# EAGLE design sistem hidroponik (EAGLE 9.5.1)
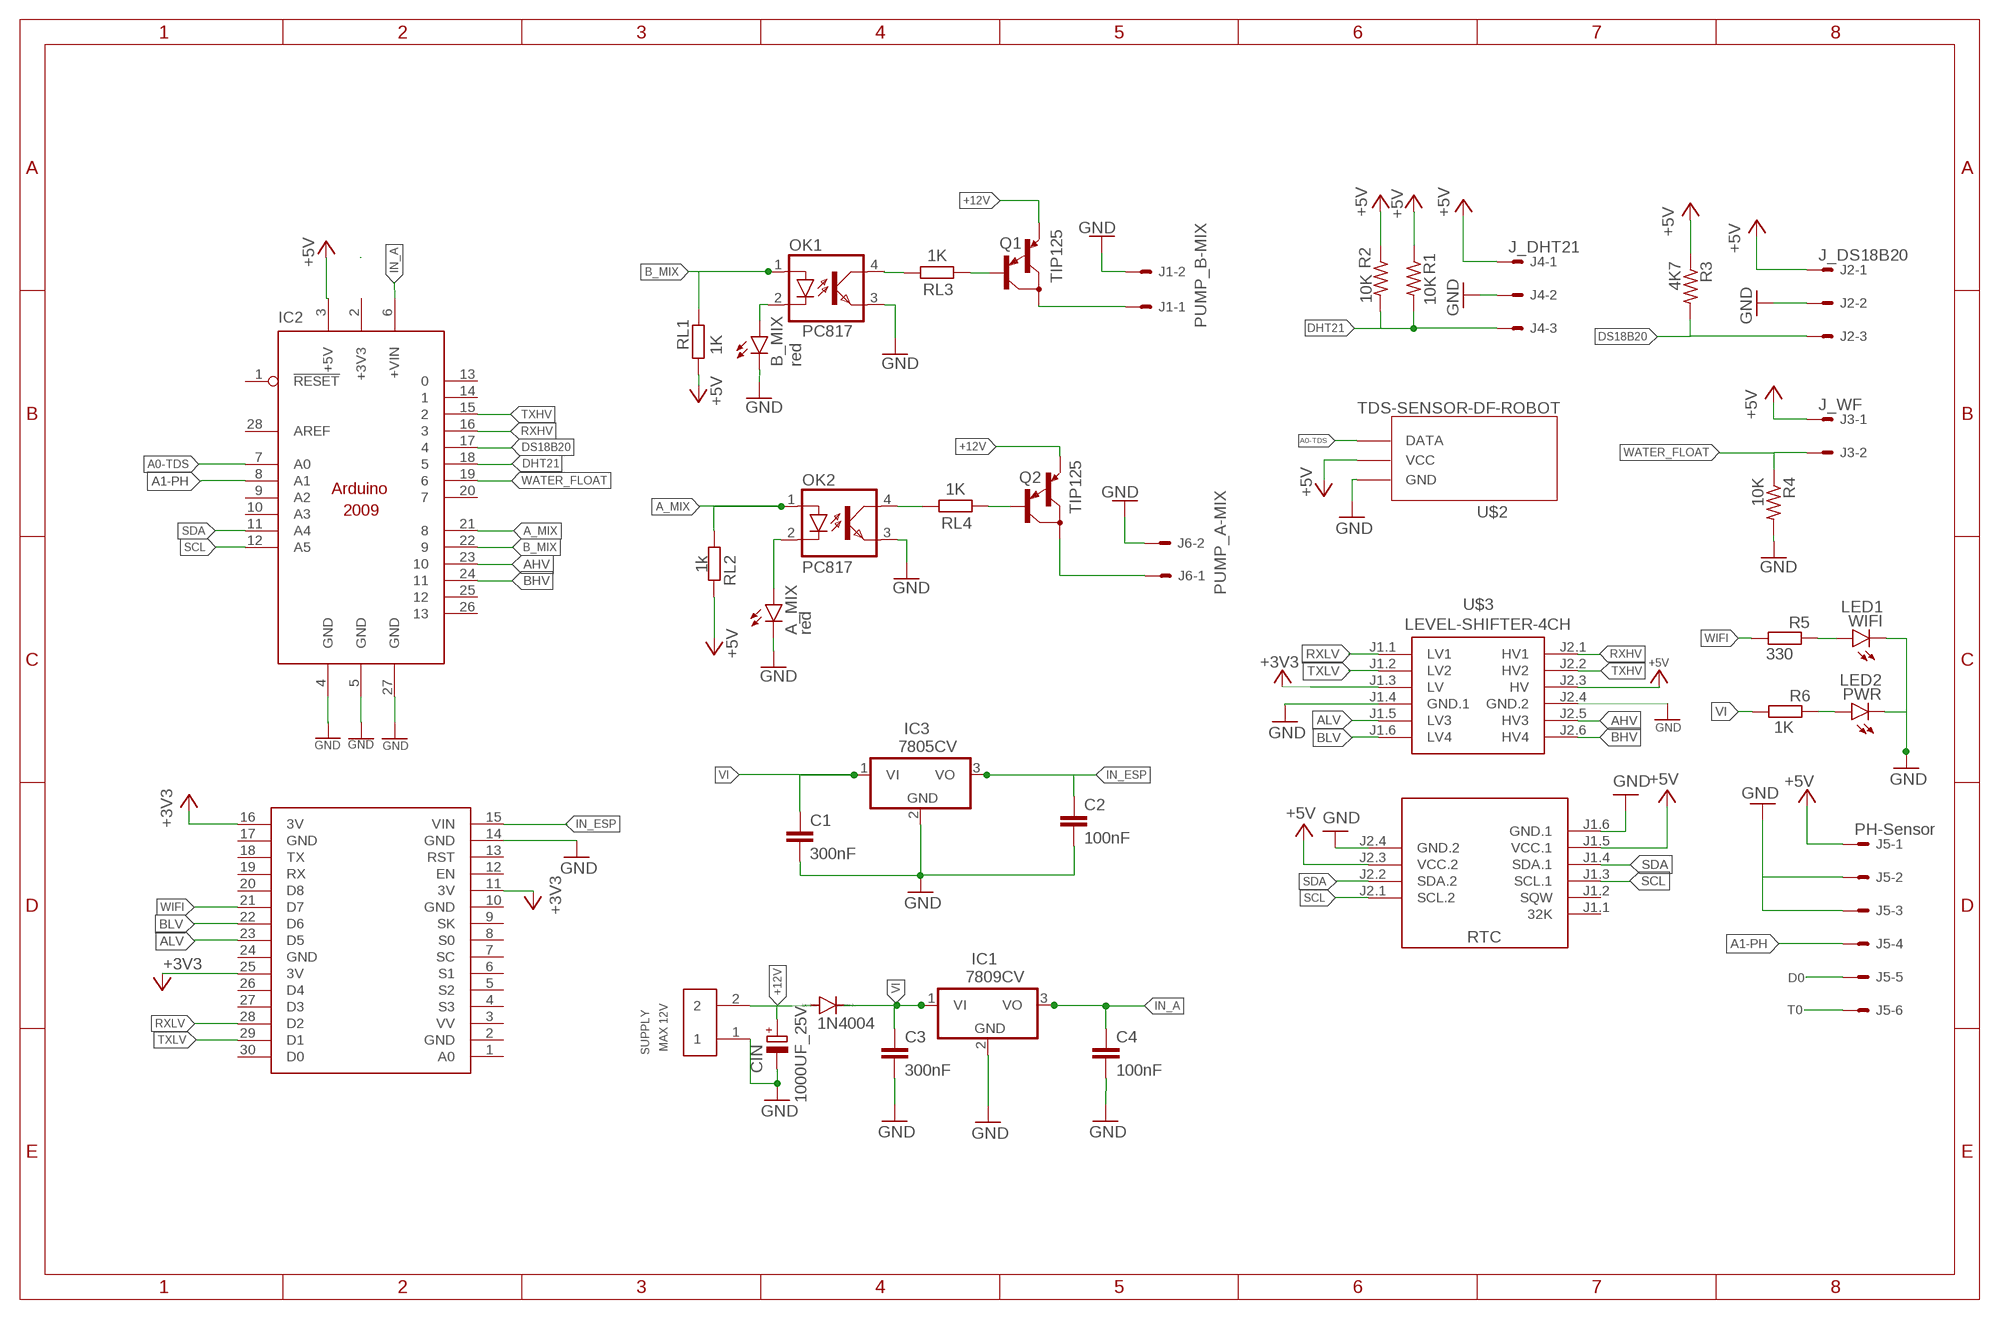
[diagram p0: schematic, sheet 1]

## Parts
1K  R6  R-EU_0207/7  [0207/7]
330  R5  R-EU_0207/7  [0207/7]
A_MIX  red  TLLR4400  [LED3MM]
B_MIX  red  TLLR4400  [LED3MM]
C1  300nF  C-EU025-030X050  [C025-030X050]
C2  100nF  C-EU025-030X050  [C025-030X050]
C3  300nF  C-EU025-030X050  [C025-030X050]
C4  100nF  C-EU025-030X050  [C025-030X050]
CIN  1000UF_25V  CPOL-EUE3.5-8  [E3,5-8]
D1  1N4004  [DO41-10]
IC1  7809CV  7805T  [TO220H]
IC2  ARDUINO2009_10  [ARDUINO2009]
IC3  7805CV  7805T  [TO220H]
J1  PUMP_B-MIX  22-27-2021-02  [6410-02]
J2  J_DS18B20  22-27-2031-03  [6410-03]
J3  J_WF  22-27-2021-02  [6410-02]
J4  J_DHT21  22-27-2031-03  [6410-03]
J5  PH-Sensor  22-27-2061-06  [6410-06]
J6  PUMP_A-MIX  22-27-2021-02  [6410-02]
OK1  PC817  [DIL04]
OK2  PC817  [DIL04]
PWR  LED2  TLLR4400  [LED3MM]
Q1  TIP125  [TO220]
Q2  TIP125  [TO220]
R1  10K  R-US_0204/7  [0204/7]
R2  10K  R-US_0204/7  [0204/7]
R3  4K7  R-US_0204/7  [0204/7]
R4  10K  R-US_0204/7  [0204/7]
RL1  1K  R-EU_0207/7  [0207/7]
RL2  1k  R-EU_0207/7  [0207/7]
RL3  1K  R-EU_0207/7  [0207/7]
RL4  1K  R-EU_0207/7  [0207/7]
RTC  RTC-DS3231-AT24C32  [RTC-DS3231-AT24C32]
SUPPLY  MAX 12V  TBLOCK-2PIN  [OST_TBLOCK-2PIN]
U$1  NODEMCU  [NODEMCU]
U$2  TDS-SENSOR-DF-ROBOT  TDS-SENSORDF-ROBOT  [TDS-SENSOR]
U$3  LEVEL-SHIFTER-4CH  [LEVEL-SHIFTER-4CH]
WIFI  LED1  TLLR4400  [LED3MM]

## Nets
+3V3: U$1.11(3V) U$1.16(3V) U$1.25(3V) U$3.J1.3(LV)
+5V: IC2.3(+5V) J2.1 J3.1 J4.1 J5.1 R1.1 R2.1 R3.1 RL1.1 RL2.2 RTC.J1.5(VCC.1) RTC.J2.3(VCC.2) U$2.VCC U$3.J2.3(HV)
+12V: CIN.+ D1.A Q1.3(E) Q2.3(E) SUPPLY.2
A0-TDS: IC2.7(A0) U$2.A(DATA)
A1-PH: IC2.8(A1) J5.4
A_MIX: IC2.21 OK2.1(A) RL2.1
AHV: IC2.23 U$3.J2.5(HV3)
ALV: U$1.23(D5) U$3.J1.5(LV3)
B_MIX: IC2.22 OK1.1(A) RL1.2
BHV: IC2.24 U$3.J2.6(HV4)
BLV: U$1.22(D6) U$3.J1.6(LV4)
D0: J5.5
DHT21: IC2.18 J4.3 R1.2 R2.2
DS18B20: IC2.17 J2.3 R3.2
GND: A_MIX.K(C) B_MIX.K(C) C1.2 C2.2 C3.2 C4.2 CIN.- IC1.2(GND) IC2.4(GND) IC2.5(GND) IC2.27(GND) IC3.2(GND) J1.2 J2.2 J4.2 J5.2 J5.3 J6.2 OK1.3(EMIT) OK2.3(EMIT) PWR.K(C) R4.2 RTC.J1.6(GND.1) RTC.J2.4(GND.2) SUPPLY.1 U$1.14(GND) U$2.GND U$3.J1.4(GND.1) U$3.J2.4(GND.2) WIFI.K(C)
IN_A: C4.1 IC1.3(VO) IC2.6(+VIN)
IN_ESP: C2.1 IC3.3(VO) U$1.15(VIN)
N$2: J1.1 Q1.2(C)
N$5: 330.1 WIFI.A
N$6: J6.1 Q2.2(C)
N$8: 1K.1 PWR.A
N$9: B_MIX.A OK1.2(C)
N$10: A_MIX.A OK2.2(C)
N$11: OK2.4(COL) RL4.2
N$14: Q2.1(B) RL4.1
N$15: Q1.1(B) RL3.1
N$16: OK1.4(COL) RL3.2
RXHV: IC2.16 U$3.J2.1(HV1)
RXLV: U$1.28(D2) U$3.J1.1(LV1)
SCL: IC2.12(A5) RTC.J1.3(SCL.1) RTC.J2.1(SCL.2)
SDA: IC2.11(A4) RTC.J1.4(SDA.1) RTC.J2.2(SDA.2)
T0: J5.6
TXHV: IC2.15 U$3.J2.2(HV2)
TXLV: U$1.29(D1) U$3.J1.2(LV2)
VI: 1K.2 C1.1 C3.1 D1.C IC1.1(VI) IC3.1(VI)
WATER_FLOAT: IC2.19 J3.2 R4.1
WIFI: 330.2 U$1.21(D7)
Unconnected: IC2.1(!RESET) IC2.9(A2) IC2.10(A3) IC2.13 IC2.14 IC2.20 IC2.25 IC2.26 IC2.28(AREF) RTC.J1.1(32K) RTC.J1.2(SQW) U$1.1(A0) U$1.3(VV) U$1.4(S3) U$1.5(S2) U$1.6(S1) U$1.7(SC) U$1.8(S0) U$1.9(SK) U$1.12(EN) U$1.13(RST) U$1.18(TX) U$1.19(RX) U$1.20(D8) U$1.26(D4) U$1.27(D3) U$1.30(D0)

## Power pins joined to a net without a drawn wire
+3V3: IC2.2(+3V3)
GND: U$1.2(GND) U$1.10(GND) U$1.17(GND) U$1.24(GND)

## Library data of the parts
1K 330 RL1-RL4 = resistor:R-EU_: RESISTOR, European symbol
A_MIX B_MIX PWR WIFI = led:TLLR4400: Low Current (2mA) LED 3 mm Tinted Diffused Package color RED Source: Data sheet <http://www.farnell.com/datasheets/391100.pdf>; MF: VISHAY SEMICONDUCTOR; OC_FARNELL: 1612437
C1-C4 = rcl:C-EU: CAPACITOR, European symbol; SPICEPREFIX: C
CIN = rcl:CPOL-EU: POLARIZED CAPACITOR, European symbol; SPICEPREFIX: C
D1 = diode:1N4004: DIODE general purpose rectifier, 1 A
IC1 IC3 = linear:78*: Positive VOLTAGE REGULATOR Source: http://cache.national.com/ds/LM/LM78L05.pdf http://www.fairchildsemi.com/ds/LM/LM7805.pdf
IC2 = arduino:ARDUINO2009_1: The Arduino Duemilanove ("2009") is a microcontroller board based on the ATmega168 or ATmega328. - 14 digital input/output pins (of which 6 can be used as PWM outputs) - 6 analog inputs, a 16 MHz crystal oscillator - USB connection - power jack - ISP header - reset button It contains everything needed to support the microcontroller; simply connect it to a computer with a USB cable or power it with a AC-to-DC adapter or battery to get started http://arduino.cc/en/Main/ArduinoBoardDuemilanove
J1 J3 J6 = con-molex:22-?-02: CONNECTOR wire to board 2.54 mm (.1 inch) pitch header; MF: MOLEX; OC_FARNELL: unknown; OC_NEWARK: unknown
J2 J4 = con-molex:22-?-03: CONNECTOR wire to board 2.54 mm (.1 inch) pitch header; MF: MOLEX; OC_FARNELL: unknown; OC_NEWARK: unknown
J5 = con-molex:22-?-06: CONNECTOR wire to board 2.54 mm (.1 inch) pitch header; MF: MOLEX; OC_FARNELL: unknown; OC_NEWARK: unknown
OK1 OK2 = optocoupler:PC817: SHARP OPTO COUPLER; MPN: PC817X4J000F; OC_FARNELL: 9707727; OC_NEWARK: 97K7059
Q1 Q2 = transistor-pnp:TIP125: PNP Transistor
R1-R4 = rcl:R-US_: RESISTOR, American symbol; SPICEPREFIX: R
RTC = diy-modules:RTC-DS3231-AT24C32: RTC Module with Battery and EEPROM based on DS3231 and AT24C32 chips Tutorial can be found here: https://edwardmallon.wordpress.com/2014/05/21/using-a-cheap-3-ds3231-rtc-at24c32-eeprom-from-ebay/ Click here to find device on ebay.com <http://www.ebay.com/sch/DS3231+AT24C32+module>
SUPPLY = OSTTA020161:TBLOCK-2PIN: Connector Terminal Blocks 2 Position 5mm Solder Straight Thru-Hole 16A; AVAILABILITY: Unavailable; DESCRIPTION: 2 Position Wire to Board Terminal Block Horizontal with Board 0.197 _5.00mm_ Through Hole; MF: On Shore; MP: OSTTA020161; PACKAGE: None; PRICE: None
U$1 = nodemcu:NODEMCU
U$2 = TDS - SENSOR DF ROBOT:TDS-SENSOR: TDS Sensor DF Robot, More information https://wiki.dfrobot.com/Gravity__Analog_TDS_Sensor___Meter_For_Arduino_SKU__SEN0244. Design BY: @SoloRoboticCenter
U$3 = diy-modules:LEVEL-SHIFTER-4CH: 4-Channel Bi-Directional Logic Level Converter based on BSS128 transistors Click here to find device on ebay.com <http://www.ebay.com/sch/i2c+logic+converter+module>

## Board
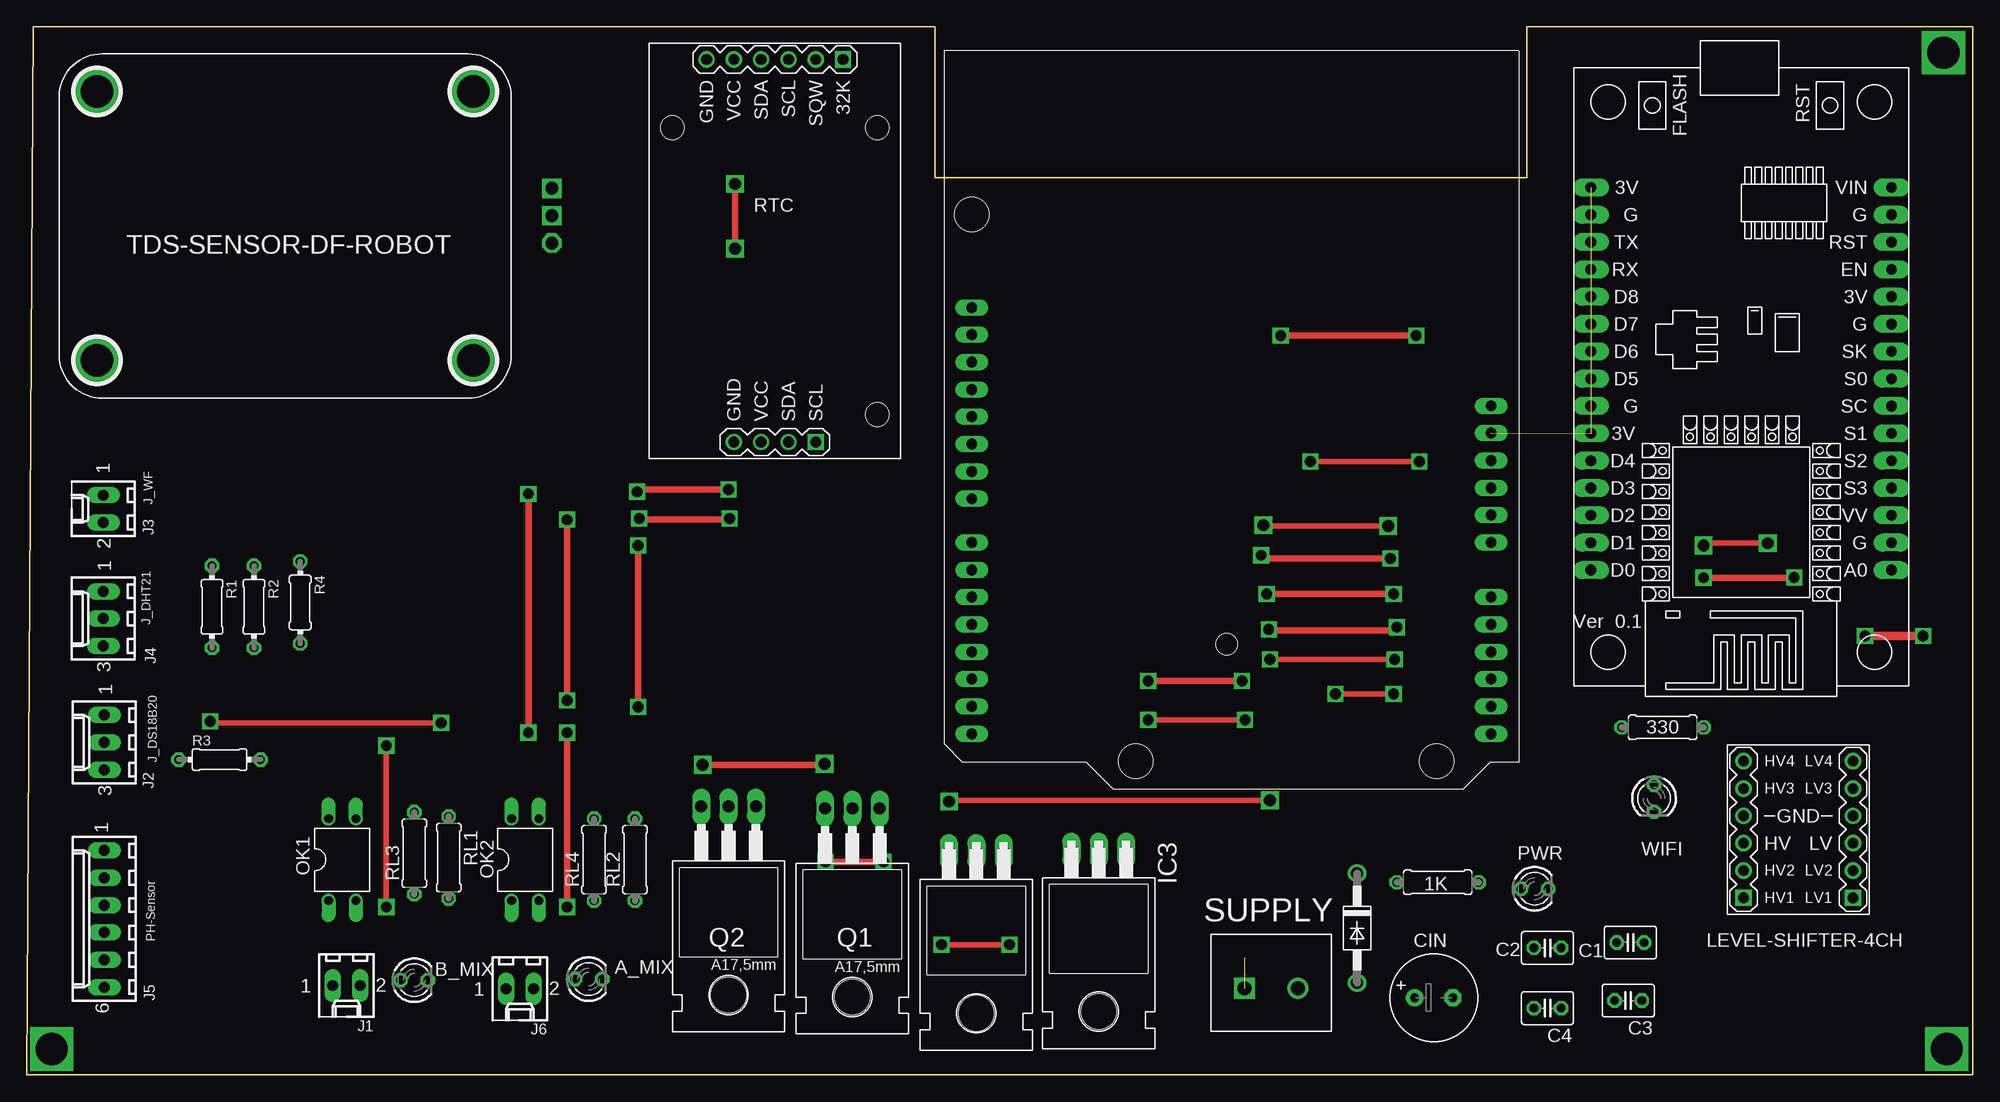
[diagram p1: board, top side]
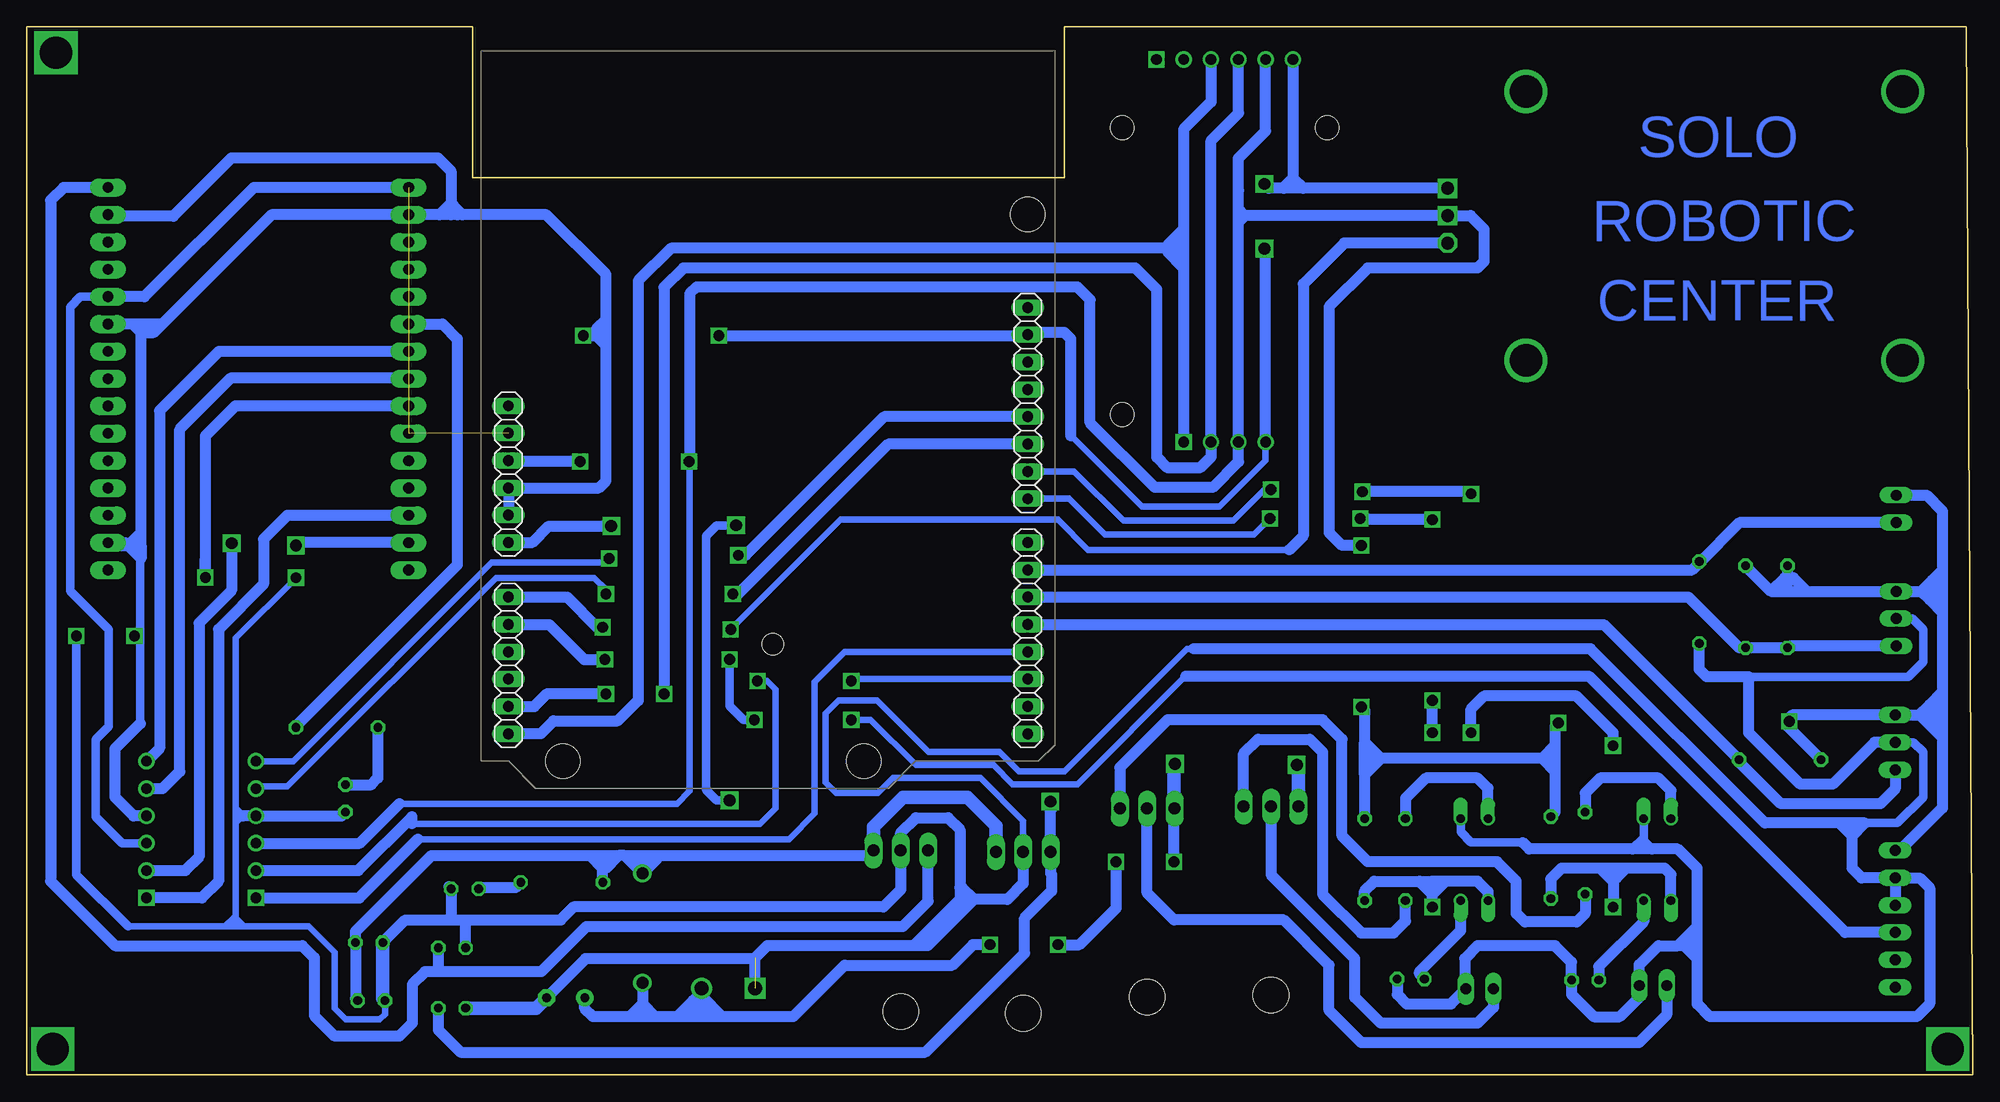
[diagram p2: board, bottom side, seen from below]

Size 180.8 x 97.4 mm. Coordinates in mm from the lower left corner, seen from the top.
Outline: 0,0 180.8,0 180.8,97.4 139.4,97.4 139.4,83.4 84.4,83.4 84.4,97.4 0.6,97.4 0,0
Copper layers (1*16): Top 0.035mm / dielectric 1.5mm / Bottom 0.035mm
Design rules "default": minimum track width 6mil, minimum drill 0.35mm, track to track 6mil, track to pad 6mil, pad to pad 6mil, via to via 6mil, smd to smd 6mil, copper to edge 40mil, drill to drill 6mil, minimum pad ring 10mil, minimum via ring 8mil, stop-mask expansion 4mil, vias tented up to drill 0mil, thermal gap 10mil

### Footprints (pad centres in the part's own frame; a part is rotated, then mirrored left to right if it is on the bottom)
0207/7 = drill 0.813 octagon: 1 -3.81,0; 2 3.81,0
LED3MM = drill 0.813 octagon: A -1.27,0; K 1.27,0
C025-030X050 = drill 0.813 octagon: 1 -1.27,0; 2 1.27,0
E3,5-8 = drill 0.813 pad 1.6: + -1.778,0 | drill 0.813 pad 1.6 octagon: - 1.778,0
DO41-10 = drill 1.118: A 5.08,0; C -5.08,0
TO220H = drill 1.118 long: 1 -2.54,-10.16; 2 0,-10.16; 3 2.54,-10.16 | hole 3.302: 0,4.826
ARDUINO2009 = drill 1.016 long: 1 33.02,2.54; 2 35.56,2.54; 3 38.1,2.54; 4 40.64,2.54; 5 43.18,2.54; 6 45.72,2.54; 7 50.8,2.54; 8 53.34,2.54; 9 55.88,2.54; 10 58.42,2.54; 11 60.96,2.54; 12 63.5,2.54; 13 63.5,50.8; 14 60.96,50.8; 15 58.42,50.8; 16 55.88,50.8; 17 53.34,50.8; 18 50.8,50.8; 19 48.26,50.8; 20 45.72,50.8; 21 41.656,50.8; 22 39.116,50.8; 23 36.576,50.8; 24 34.036,50.8; 25 31.496,50.8; 26 28.956,50.8; 27 26.416,50.8; 28 23.876,50.8 | hole 3.2: 15.24,50.8; 66.04,35.56; 66.04,7.62 | hole 2: 55.17,27.114
6410-02 = drill 1.016 long: 1 1.27,0; 2 -1.27,0
6410-03 = drill 1.016 long: 1 2.54,0; 2 0,0; 3 -2.54,0
6410-06 = drill 1.016 long: 1 6.35,0; 2 3.81,0; 3 1.27,0; 4 -1.27,0; 5 -3.81,0; 6 -6.35,0
DIL04 = drill 0.813 offset: 1 -1.27,-3.81; 2 1.27,-3.81; 3 1.27,3.81; 4 -1.27,3.81
TO220 = drill 1.118 long: 1 -2.54,-6.35; 2 0,-6.35; 3 2.54,-6.35 | hole 3.302: 0,11.176
0204/7 = drill 0.813 octagon: 1 -3.81,0; 2 3.81,0
RTC-DS3231-AT24C32 = drill 1 square: J1.1 -17.78,6.35; J2.1 17.78,3.81 | drill 1: J1.2 -17.78,3.81; J1.3 -17.78,1.27; J1.4 -17.78,-1.27; J1.5 -17.78,-3.81; J1.6 -17.78,-6.35; J2.2 17.78,1.27; J2.3 17.78,-1.27; J2.4 17.78,-3.81 | hole 2.2: -11.43,-9.525; -11.43,9.525; 15.24,9.525
OST_TBLOCK-2PIN = drill 1.3 square: 1 -2.5,0 | drill 1.3: 2 2.5,0
NODEMCU = drill 1 pad 1.676 long: 1 -13.97,17.78; 2 -13.97,15.24; 3 -13.97,12.7; 4 -13.97,10.16; 5 -13.97,7.62; 6 -13.97,5.08; 7 -13.97,2.54; 8 -13.97,0; 9 -13.97,-2.54; 10 -13.97,-5.08; 11 -13.97,-7.62; 12 -13.97,-10.16; 13 -13.97,-12.7; 14 -13.97,-15.24; 15 -13.97,-17.78; 16 13.97,-17.78; 17 13.97,-15.24; 18 13.97,-12.7; 19 13.97,-10.16; 20 13.97,-7.62; 21 13.97,-5.08; 22 13.97,-2.54; 23 13.97,0; 24 13.97,2.54; 25 13.97,5.08; 26 13.97,7.62; 27 13.97,10.16; 28 13.97,12.7; 29 13.97,15.24; 30 13.97,17.78
TDS-SENSOR = drill 3: 1 -39.5,-2.5; 2 -39.5,-27.5; 3 -4.5,-2.5; 4 -4.5,-27.5 | drill 1.2 octagon: A 2.78,-16.58 | drill 1.2 square: GND 2.78,-11.5; VCC 2.78,-14.04
LEVEL-SHIFTER-4CH = drill 1 square: J1.1 -5.08,6.35; J2.1 5.08,6.35 | drill 1: J1.2 -5.08,3.81; J1.3 -5.08,1.27; J1.4 -5.08,-1.27; J1.5 -5.08,-3.81; J1.6 -5.08,-6.35; J2.2 5.08,3.81; J2.3 5.08,1.27; J2.4 5.08,-1.27; J2.5 5.08,-3.81; J2.6 5.08,-6.35

### Placement (x,y rotation side)
1K  131.1,17.9 180 top
330  152,32.3 0 top
A_MIX  52.2,8.9 0 top
B_MIX  36,8.8 0 top
C1  149,12.3 180 top
C2  141.3,11.8 180 top
C3  148.8,6.9 180 top
C4  141.3,6.2 180 top
CIN  130.74,7.17 0 top
D1  123.61,13.64 270 top
IC1  88.22,10.55 180 top
IC2  138.6,95.2 270 bottom
IC3  99.6,10.7 180 top
J1  29.7,8.3 180 top
J2  7.2,30.9 90 top
J3  7.1,52.6 90 top
J4  7.1,42.4 90 top
J5  7.2,14.5 90 top
J6  45.8,8 180 top
OK1  29.3,20 0 top
OK2  46.3,20 0 top
PWR  140.1,17.3 0 top
Q1  76.7,18.4 180 top
Q2  65.2,18.6 180 top
R1  17.2,43.5 270 top
R2  21.1,43.5 270 top
R3  17.9,29.3 0 top
R4  25.4,43.9 270 top
RL1  39.2,20.2 270 top
RL2  56.5,20 90 top
RL3  36,20.6 90 top
RL4  52.7,20 90 top
RTC  69.5,76.6 270 top
SUPPLY  115.63,8.05 0 top
U$1  159.3,64.7 180 top
U$2  46,93.9 0 top
U$3  164.6,22.8 180 top
WIFI  151.2,25.7 270 top

### Tracks (layer width: path | path; a pad name or v marks a point on that pad's centre or on a via)
+3V3  (2 unrouted)
  Bottom 0.813: U$1.11 175.82,72.32 176.77,71.37 176.77,44.97 173.2,41.4 173.2,32.4 174.4,31.2 174.4,24 171.93,21.53 U$3.J1.3
  Bottom 1.016: U$1.16 159.72,82.48 169.88,72.32 U$1.11
+5V  (via drill 1)
  Top 0.508: v129.4,57 v119.28,57 | v17.04,32.84 17.64,32.84 17.5,32.7 v38.5,32.7
  Top 0.61: v56.8,49.2 v56.8,34.2
  Bottom 0.61: v119.28,57 119.2,56.92 119.2,26.4 120.4,25.2 146.2,25.2
  Bottom 1.016: J3.1 4.27,53.87 2.8,52.4 2.8,46.9 | 2.8,42.98 2.8,35.6 | 4,33.2 4,34.4 | 4,33.2 4,32.54 | 2.8,31.34 2.8,24.8 6.8,20.8 7.15,20.8 J5.1 | J2.1 4.9,33.44 | 4.9,33.44 4.24,33.44 4,33.2 | 4.76,44.94 J4.1 15.4,44.94 | 4.76,44.94 4,45.7 | 4,45.7 3.75,45.95 | 3.75,45.95 2.8,46.9 | 4.76,44.94 4,44.18 | 4,44.18 2.8,42.98 | J2.1 4.96,33.44 4,34.4 | 4,34.4 2.8,35.6 | 4.9,33.44 4,32.54 | 4,32.54 2.8,31.34 | 68.23,79.23 RTC.J2.3 68.2,58.79 68.2,57 70.6,54.6 76,54.6 82,60.6 82,72.03 83.2,73.23 118.57,73.23 119.2,72.6 119.2,57.08 v119.28,57 | 68.23,79.23 68.23,79.8 | 68.23,79.8 68.23,80.49 | 68.23,80.49 68.23,85.17 68.2,85.2 | 68.2,82.2 68.2,85.2 | RTC.J1.5 65.69,87.71 68.2,85.2 | 67.6,79.86 U$2.VCC 46.66,79.86 45.4,78.6 45.4,75.6 46,75 56.2,75 59.8,71.4 59.8,50.4 58.6,49.2 v56.8,49.2 | 67.6,79.86 68.17,79.86 68.23,79.8 | 67.6,79.86 68.23,80.49 | 68.23,79.23 67.6,79.86 | 40,29.4 55,29.4 | 55,29.4 56.5,27.9 | 56.5,27.9 RL2.2 | U$3.J2.3 149.87,21.53 146.2,25.2 | v129.4,57 135.96,57 IC2.3 | R2.1 18.73,44.94 | 18.73,44.94 17.8,44.94 | 17.8,44.94 17.2,44.94 | 17.2,44.94 15.4,44.94 | R1.1 17.2,46.2 | 17.2,44.94 17.2,46.2 | 17.2,46.2 17.8,45.6 17.8,44.94 | 17.2,46.2 17.47,46.2 18.73,44.94 | 17.2,46.2 16.66,46.2 15.4,44.94 | 2.8,35.6 2.8,33.6 | 2.8,33.6 2.8,31.34 | 4,34.4 3.4,33.8 3.4,33 2.8,33.6 | 2.8,46.9 2.8,42.98 | 4,45.7 4,44.4 | 4,44.18 4,44.4 | 3.75,45.95 3.4,45.6 3.4,45 4,44.4 | 4,44.4 | 4,44.4 3.4,44.4 | 17.2,33 v17.04,32.84 | v38.5,32.7 38.8,32.4 38.8,30.6 | 38.8,30.6 38.8,29.4 | 38.8,29.4 38.8,28.2 | 38.8,28.2 38.8,24.41 RL1.1 | 40,29.4 38.8,29.4 | 38.8,30.6 40,29.4 | 40,29.4 38.8,28.2 | v56.8,34.2 56.5,33.9 56.5,30.9 | 56.2,30.6 55,29.4 | 56.5,27.9 56.5,29.1 | 56.5,29.1 56.2,29.4 56.2,30.6
  Bottom 1.016: 56.2,30.6 56.5,30.9 | 56.5,29.1 56.5,30.9 | R3.1 17.2,32.41 17.2,33 | J2.1 16.76,33.44 17.2,33
+12V  (via drill 1, 1.1)
  Top 0.508: v91.3,12.1 v85,12.1
  Top 0.61: v74.11,28.89 74.02,28.8 v62.8,28.8 | v79.6,19.8 v74.2,19.8
  Bottom 1.016: SUPPLY.2 118.13,7.33 116.2,5.4 | 116.2,5.4 109.6,5.4 104.8,10.2 94.8,10.2 92.9,12.1 v91.3,12.1 | v85,12.1 83,12.1 79.6,15.5 v79.6,19.8 | v74.2,19.8 74.2,24.79 | 116.2,5.4 118.6,5.4 | 118.6,5.4 120.4,5.4 | 120.4,5.4 122.41,5.4 | 122.41,5.4 123.4,5.4 | 123.4,5.4 124.81,5.4 | 124.81,5.4 128.2,5.4 128.96,6.16 CIN.+ | D1.A 123.61,6.6 | 123.61,6.6 123.61,5.61 123.4,5.4 | 123.61,6.6 122.41,5.4 | 123.61,6.6 124.81,5.4 | SUPPLY.2 118.13,7.67 118.9,6.9 | 118.9,6.9 119.5,6.3 | 119.5,6.3 120.4,5.4 | 118.13,5.87 118.6,5.4 | SUPPLY.2 118.13,6 | 118.13,6 118.13,5.87 | 118.13,5.87 119.07,5.87 | 119.5,6.3 119.07,5.87 | 119.07,5.87 118.9,6.04 118.9,6.9 | 118.13,5.87 117.53,5.87 117.4,6 118.13,6
  Bottom 1.27: v62.8,28.8 62.66,28.66 Q2.3 | v74.11,28.89 74.2,28.8 74.2,24.79 Q1.3
A0-TDS  (via drill 1)
  Top 0.61: v127.3,41.6 127,41.3 115.5,41.3 v115.4,41.4
  Bottom 0.61: 63.5,48.8 82.2,48.8 85,51.6 105.2,51.6 v115.4,41.4
  Bottom 1.016: U$2.A 58.38,77.32 62.2,73.5 62.2,50.1 63.5,48.8 | IC2.7 130.6,44.4 127.8,41.6 v127.3,41.6
A1-PH  (via drill 1)
  Top 0.508: v127.1,38.6 v115.5,38.6 | v113.2,33 v104.2,33
  Bottom 0.61: v104.2,33 102.4,33 98.2,28.8 91,28.8 89.2,27 83.2,27 73.14,37.06
  Bottom 0.813: v115.5,38.6 115.5,34.3 114.2,33 v113.2,33
  Bottom 1.016: J5.4 11.83,13.23 35.66,37.06 73.14,37.06 | IC2.8 132.26,41.86 129,38.6 v127.1,38.6
A_MIX  (via drill 1)
  Top 0.61: v65.3,51.7 65.2,51.6 57,51.6 v56.9,51.7 | v50.2,15.6 v50.2,31.8 | v50.2,34.8 v50.2,51.6
  Bottom 0.61: IC2.21 83.94,53.54 80.6,50.2 66.8,50.2 v65.3,51.7 | v56.9,51.7 54.5,51.7 54.4,51.6
  Bottom 1.016: RL2.1 56.5,17.1 55.6,18 51.4,18 | 51.4,18 50.2,18 | 49,18 46,18 45.03,17.03 OK2.1 | 49,18 50.2,18 | 50.2,18 50.2,16.8 | v50.2,15.6 50.2,16.8 | 50.2,34.2 v50.2,31.8 v50.2,34.8 | v50.2,51.6 56.8,51.6 v56.9,51.7 | 50.2,16.8 51.4,18 | 50.2,16.8 49,18
AHV  (via drill 1)
  Top 0.61: v127,44.7 v115.2,44.7
  Bottom 0.61: U$3.J2.5 159.33,26.8 156.6,26.8 137.2,46.2 128.1,46.2 127,45.1 v127,44.7
  Bottom 1.016: IC2.23 100.78,58.62 114.7,44.7 v115.2,44.7
ALV
  Bottom 1.016: U$3.J1.5 168.19,26.61 166.6,28.2 166.6,60 161.8,64.8 145.43,64.8 U$1.23
B_MIX  (via drill 1)
  Top 0.508: v33.4,30.6 v33.4,15.6
  Top 0.61: v65.2,54.4 57.1,54.4 56.9,54.2 v56.7,54.2 | v46.6,31.8 v46.6,54
  Bottom 0.61: IC2.22 83.48,56.08 78.9,51.5 68.7,51.5 65.8,54.4 v65.2,54.4
  Bottom 1.016: OK1.1 28.03,18.63 28.6,19.2 32.2,19.2 | 32.2,19.2 34,19.2 | 34,19.2 34.6,19.2 | 34.6,19.2 38.2,19.2 39.2,18.2 RL1.2 | 32.2,19.2 33.1,18.3 | 33.1,18.3 33.4,18 | 33.4,18 v33.4,15.6 | v33.4,30.6 33.4,31.8 36.8,35.2 45.4,35.2 46.6,34 v46.6,31.8 | v46.6,54 46.8,54.2 v56.7,54.2 | 33.1,18.3 34,19.2 | 33.4,18 34.6,19.2
BHV  (via drill 1)
  Top 0.61: v126.7,48 115,48 v114.7,48.3
  Bottom 0.61: U$3.J2.6 156.05,29.15 137.6,47.6 127.1,47.6 v126.7,48
  Bottom 1.016: IC2.24 101.14,61.16 114,48.3 v114.7,48.3
BLV
  Bottom 1.016: U$1.22 162.96,67.24 168.48,61.72 168.48,30.35 U$3.J1.6
DHT21
  Bottom 1.016: IC2.18 26.41,44.4 21.7,39.69 R2.2 R1.2 17.03,39.86 J4.3
DS18B20
  Bottom 1.016: J2.3 7.2,26.56 8.56,25.2 17.8,25.2 21.71,29.11 R3.2 34.27,41.86 IC2.17
GND  (via drill 1, 1.1)  (1 unrouted)
  Top 0.61: v65.8,76.8 v65.8,82.8 | v164.22,46.22 164.2,46.2 v155.8,46.2 | v129.1,68.7 v116.5,68.7
  Top 0.813: v176.2,40.8 v170.8,40.8
  Bottom 0.61: 161.4,24.8 160.67,24.07 160.73,24.07 161.4,23.4 | 161.4,24.8 161.4,40.6 v155.8,46.2 | 161.4,24.8 161.4,23.4 | 161.4,23.4 161.4,14.6 | C3.2 147.53,5.64 148,5.17 151.2,5.17 152.2,6.17 152.2,11.4 154.6,13.8 160.6,13.8 | 160.6,13.8 161.2,13.8 | 161.2,13.8 161.8,13.8 | 161.8,13.8 162.4,13.8 | 162.4,13.8 171.4,13.8 | U$1.17 143.2,79.94 | 161.4,14.6 161.8,14.2 161.8,13.8 | 161.4,14.6 161.6,14.6 162.4,13.8 | 161.2,14.4 160.6,13.8 | 161.4,14.6 161.2,14.4 | 161.2,14.4 161.2,13.8 | IC1.2 88.22,23.62 92.2,27.6 100.3,27.6 101.7,26.2 105.6,26.2 106.6,27.2 106.6,33.6 105.4,34.8 101.8,34.8 97,30 90.4,30 88.6,28.2 84.4,28.2 73,39.6 72.4,39.6 71.8,39.6 | 127.3,69.3 127,69.6 | RTC.J2.4 65.69,57.11 70,52.8 77.2,52.8 83.8,59.4
  Bottom 0.813: 41.8,21.6 46.6,21.6 47.57,22.57 OK2.3 | 29.8,21 30.57,21.77 OK1.3 30.57,22.03 31.6,21 | U$1.2 170.87,49.46 170.27,48.86 170.27,40.8 | 170.27,40.8 170.27,32.66 | 171.4,13.8 176.2,18.6 v176.2,40.8 | v170.8,40.8 170.27,40.8 | J2.2 5.5,30.9 4.6,30 4.6,25.8 7,23.4 10,23.4 | J4.2 5.6,42.4 4.6,41.4 4.6,38.4 6,37 21.4,37
  Bottom 1.016: J2.2 9.1,30.9 13,27 16,27 20.8,31.8 20.8,37 21.4,37 24.71,37 25.4,37.69 R4.2 | 63.15,86.75 RTC.J1.6 63.15,83.35 | RTC.J2.4 65.69,76.69 v65.8,76.8 | U$2.GND 62.2,82.4 | 62.2,82.4 64,82.4 | 64,82.4 65.4,82.4 v65.8,82.8 | 62.2,82.4 63.15,83.35 | 63.15,83.35 64,82.5 64,82.4 | A_MIX.K 53.47,7.47 52.6,6.6 48.47,6.6 J6.2 47.2,8.13 47.2,10.8 46,12 38.8,12 37.27,10.47 B_MIX.K 37.27,7.47 35.2,5.4 32.8,5.4 30.97,7.23 J1.2 30.97,10.23 29.2,12 27.4,12 | 27.4,12 25.6,13.8 | 25.6,13.8 25.6,19.2 27.4,21 29.8,21 31.6,21 41.2,21 41.8,21.6 | CIN.- 128.89,10.8 113.13,10.8 SUPPLY.1 | 94.11,16.31 98.42,12 | 98.42,12 112,12 113.13,10.87 | 94.11,17.4 94.11,22.81 95.2,23.9 98.2,23.9 99.6,22.5 IC3.2 99.6,17.2 101.2,15.6 130,15.6 131.2,14.4 140.03,14.4 | 94.11,17.4 94.11,16.31 | U$1.24 161.44,62.16 164.22,59.38 v164.22,46.22 164.22,47.98 164.2,48 | 168.22,69.78 170.2,69.78 | 170.2,69.78 170.98,69.78 | 170.98,69.78 U$1.10 | 168.22,69.78 158.06,79.94 U$1.17 142.46,79.94 | 170.2,69.78 170.2,69 | 170.2,50.4 170.2,69 | 170.2,49.2 170.2,50.4 | 170.2,49.2 170.2,48 170.87,48.67 | U$3.J1.4 170.88,24.07 172.6,25.79 172.6,30.33 170.27,32.66 | 171.4,49.2 173.01,49.2 U$1.2 171.66,49.46 170.87,48.67 | 171.4,49.2 170.2,49.2 | 170.87,49.73 170.87,49.46 170.87,48.67 | 170.87,49.73 170.2,50.4 | 171.4,49.2 170.87,49.73 | 170.2,69 169,69 168.22,69.78 | 170.2,69 170.98,69.78 | C1.2 145.63,14.4 141.4,14.4 | 141.4,14.4 140.03,14.4 | C2.2 140.03,14.4 | 141.4,14.4 141.4,17.27 PWR.K 141.57,17.5 | 160.73,24.07 U$3.J2.4 151.56,24.07 WIFI.K | IC2.5 IC2.4 127.64,54.56 127,55.2 127,67.8 | 127,67.8 127,68.4 | 127,68.4 127,69.6 127,70.2 | 127,70.2 127,74.4 132.54,79.94 140.34,79.94
  Bottom 1.016: 140.34,79.94 140.8,79.94 | 140.8,79.94 141.4,79.94 | 141.4,79.94 142.46,79.94 | 141.4,79.94 141.4,81 | 141.4,81 141.4,84 142.6,85.2 161.8,85.2 167.2,79.8 173.8,79.8 173.66,79.94 U$1.14 | 141.4,81 140.8,80.4 | 140.8,80.4 140.8,79.94 | 141.4,81 142.46,79.94 | 140.8,80.4 140.34,79.94 | J5.2 J5.3 | 11.2,23.4 10,23.4 11.2,22.2 | 11.2,23.4 12.4,23.4 | 12.4,23.4 19.3,23.4 35.5,39.6 72.4,39.6 | J5.2 10.31,18.31 11.2,19.2 11.2,22.2 | 11.2,23.4 11.2,22.2 | 11.2,22.2 12.4,23.4 | IC1.2 88.22,17.78 89.69,16.31 92.8,16.31 | 94.11,16.31 92.8,16.31 | 92.8,16.31 93.89,17.4 94.11,17.4 | 92.8,16.31 97.11,12 98.42,12 | v116.5,68.7 88.3,68.7 88.22,68.78 IC2.27 87.58,69 84.4,69 83.8,68.4 83.8,59.4 | 127.3,68.7 v129.1,68.7 127.9,68.7 127,67.8 | 127.9,69.3 127.3,69.3 | 127,70.2 127.9,69.3 | 127.9,69.3 127.3,68.7 | 127.3,68.7 127,68.4 | J5.2 4.91,18.31 4,17.4 4,6.6 5.2,5.4 24.4,5.4 25.6,6.6 25.6,10.8 | 25.6,10.8 25.6,11.4 | 25.6,11.4 25.6,13.8 | 25.6,11.4 26.2,12 26.8,12 | 25.6,10.8 26.8,12 | 26.8,12 27.4,12
  Bottom 1.27: C4.2 133.49,6.2 CIN.- | C1.2 147.73,7.1 C3.2
IN_A  (via drill 1.1)
  Top 0.508: v126.5,51 114.9,51 | v115.5,25.5 85.7,25.5
  Top 1.016: 114.9,51 v114.9,51.08 | v85.7,25.4 85.7,25.5
  Bottom 0.813: v115.5,25.5 116.7,25.5 117.7,26.5 117.7,29.1 117.7,29.7 117.7,50.1 116.72,51.08 v114.9,51.08
  Bottom 1.016: C4.1 142.57,4.17 140.5,2.1 97.3,2.1 88.1,11.3 88.1,14.58 85.58,17.1 85.58,18.61 85.68,18.71 IC1.3 85.68,24.62 85.5,24.8 85.7,25 v85.7,25.4 | IC2.6 133.82,49.48 132.3,51 v126.5,51
IN_ESP
  Bottom 1.016: C2.1 142.57,9.6 | 142.57,9.6 133,9.6 128.8,13.8 99.4,13.8 97.06,16.14 IC3.3 | 142.57,9.6 143.8,9.6 145,8.4 145,4.8 146.2,3.6 152.2,3.6 154.1,5.5 154.1,10.9 155.2,12 172.6,12 178.6,18 178.6,81.28 177.4,82.48 U$1.15
N$2
  Bottom 1.016: J1.1 28.43,5.57 31,3 56.8,3 59.8,6 59.8,10.2 64,14.4 74.2,14.4 76.7,16.9 Q1.2
N$5
  Bottom 1.016: WIFI.A 148.8,26.97 148.19,27.58 330.1
N$6
  Bottom 1.016: J6.1 44.53,6.27 46,4.8 55,4.8 57.4,7.2 57.4,10.8 65.2,18.6 Q2.2
N$8
  Bottom 1.016: 1K.1 135.41,17.4 138.73,17.4 PWR.A
N$9
  Bottom 1.016: B_MIX.A 34.73,10.07 30.57,14.23 OK1.2
N$10
  Bottom 1.016: A_MIX.A 51.4,9.37 51.4,9.6 47.57,13.43 OK2.2
N$11
  Bottom 1.016: OK2.4 45.03,26.63 46,27.6 50.8,27.6 52.7,25.7 RL4.2
N$12  (via drill 3)
  other vias: 2.3,2.4
N$13  (via drill 3)
  other vias: 178.1,95
N$14
  Bottom 1.016: Q2.1 67.74,29.86 66.4,31.2 61.6,31.2 60.4,30 60.4,16.8 56.8,13.2 53.8,13.2 52.7,14.3 RL4.1
N$15
  Bottom 1.016: RL3.1 36,14.99 36.79,14.2 41.6,14.2 42.4,15 42.4,18 44.2,19.8 56.2,19.8 58.6,22.2 58.6,31.2 60.4,33 74.8,33 79.24,28.56 Q1.1
N$16
  Bottom 1.016: OK1.4 28.03,26.43 29.2,27.6 34.6,27.6 36,26.2 RL3.2
N$17  (via drill 3)
  other vias: 178.4,2.4
RXHV
  Bottom 0.61: 144.47,21.9 110,21.9 107.6,24.3 107.6,36.52 104.8,39.32 IC2.16
  Bottom 1.016: U$3.J2.1 149.92,16.45 144.47,21.9
RXLV
  Bottom 1.016: 169.35,16.45 U$3.J1.1 164.55,16.45 163,18 163,41.4 158.8,45.6 158.8,49.8 156.6,52 U$1.28
SCL
  Bottom 1.016: RTC.J1.3 70.77,90.43 73.31,87.89 73.31,78.6 | 73.31,78.6 73.31,76.84 | 73.31,76.84 73.31,75.6 | 73.31,75.6 73.31,75 | 73.31,75 RTC.J2.1 | 73.31,76.84 74.55,76.84 | 74.8,76.84 120.96,76.84 124,73.8 124,34.8 125.9,32.9 131.86,32.9 133.06,31.7 IC2.12 | 73.31,75.6 74.55,76.84 | 74.55,76.84 74.8,76.84 | 73.31,78.6 74.8,77.11 74.8,76.84 | 73.31,75 74.8,76.49 74.8,76.84
SDA  (via drill 1)
  Top 0.508: v127,35.4 v121.6,35.4
  Bottom 1.016: RTC.J1.4 68.2,94.35 68.2,89.4 70.77,86.83 RTC.J2.2 70.77,57.43 71.8,56.4 74.8,56.4 75.8,57.4 75.8,73 77.8,75 119.8,75 121.6,73.2 v121.6,35.4 | IC2.11 133.66,34.24 132.46,35.44 127.04,35.44 v127,35.4
TXHV  (via drill 1)
  Top 0.61: v104.2,36.6 v112.92,36.6
  Bottom 0.61: 145.02,23.34 112.66,23.34 111.22,24.78 111.22,35.82 112,36.6 v112.92,36.6 | v104.2,36.6 104.02,36.78 IC2.15
  Bottom 1.016: U$3.J2.2 150.01,18.99 145.02,23.98 145.02,23.34
TXLV  (via drill 1.1)
  Top 0.508: v155.8,49.2 156.01,49.41 v161.77,49.41
  Bottom 1.016: U$1.29 155.54,49.46 v155.8,49.2 | U$3.J1.2 166.08,18.99 164.8,20.27 164.8,42 161.77,45.03 v161.77,49.41
VI
  Bottom 1.016: C3.1 150.27,7.1 C1.1 150.27,13.33 143.21,20.39 128.48,20.39 | 128.48,20.39 127,20.39 | 127,20.39 125.8,20.39 | 125.28,20.39 124,20.39 | 124,20.39 122.2,20.39 | 122.2,20.39 102.14,20.39 | D1.C 123.61,20 124,20.39 | 1K.2 127.29,19.2 | 127.29,19.2 127.29,20.1 127,20.39 | 127.29,19.2 128.48,20.39 | 127.29,19.2 126.99,19.2 125.8,20.39 | D1.C 122.2,20.13 122.2,20.39 | D1.C 125.28,20.39 | 125.28,20.39 125.8,20.39 | IC1.1 90.76,21.6 | IC3.1 102.14,21.6
  Bottom 1.27: 90.76,21.6 90.76,23.16 93.4,25.8 99.4,25.8 102.14,23.06 102.14,21.6 102.14,20.39
WATER_FLOAT
  Bottom 1.016: 25.46,47.54 25.4,47.54 R4.1 | IC2.19 26.06,46.94 25.46,47.54 | J3.2 21.67,51.33 25.46,47.54
WIFI
  Bottom 1.016: U$1.21 142.18,69.78 140.8,68.4 140.8,47.4 155.81,32.39 330.2

### Text on the board
Bottom: SOLO | ROBOTIC | CENTER